# Altium schematic sheet Sheet1.SchDoc: Arduino_Nano
size A; Author: Hassan Mustafa; CompanyName: ControlMan; SheetNumber: 1; SheetTotal: 1
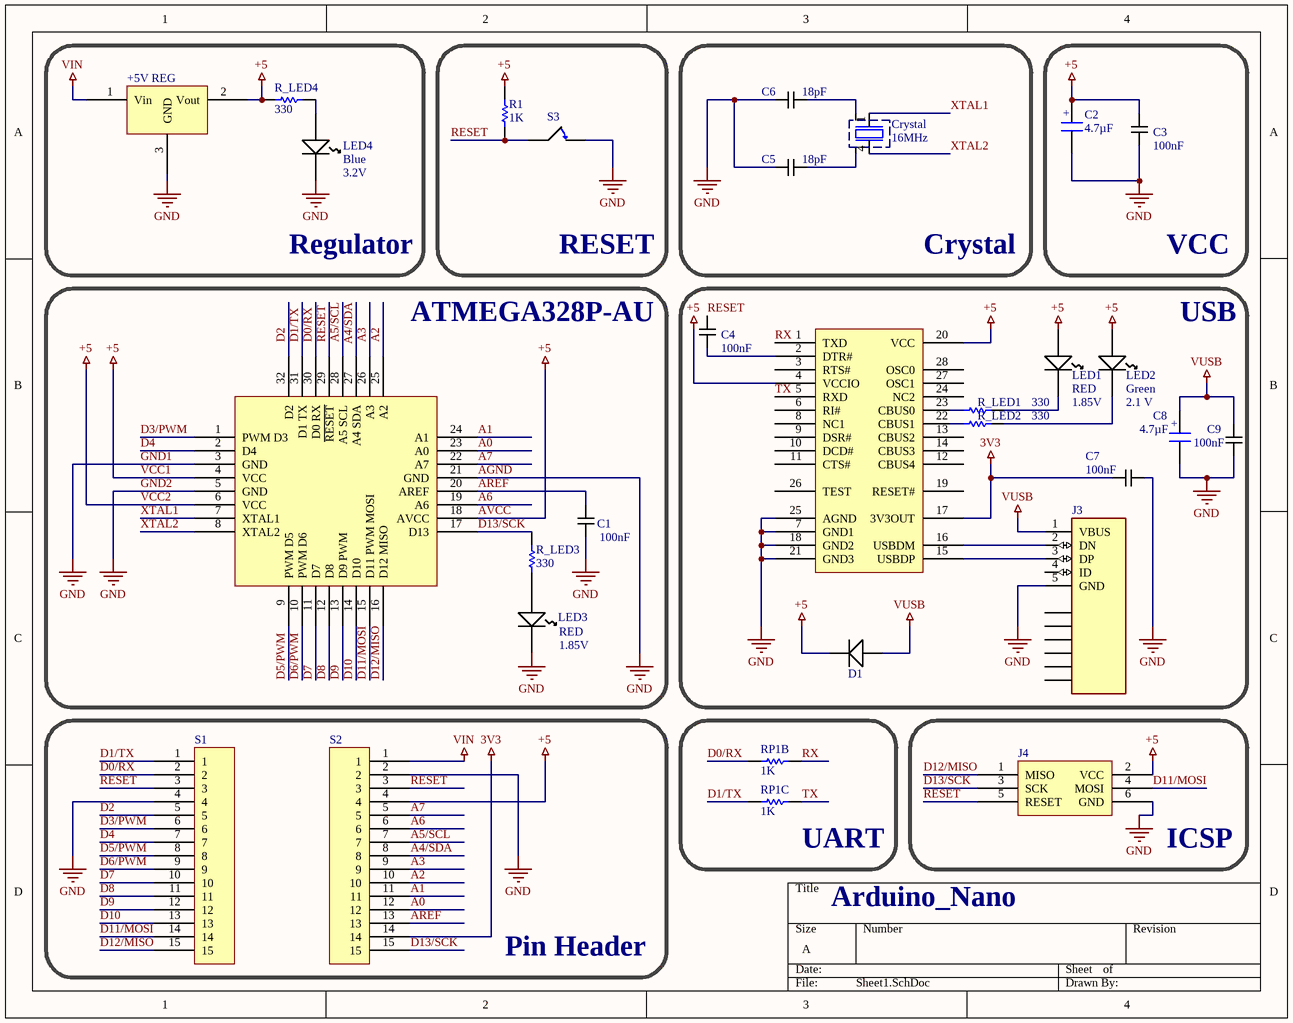
[diagram p0: Sheet1.SchDoc]

## Parts
+5V_REG  LM1117MP-5.0/NOPB, Low Dropout Voltage Regulator, 1.5A, 5 V ±1%, 4-Pin SOT-223  [SOT230P700X180-4N]  (value not drawn)
C1  Capacitance: 100nF  [CAPCP2012X09N]  (hidden comment: 100nF Ceramic Multilayer Capacitor_1)
C2  value 4.7µF  [CASE A - 3216X18]  (hidden comment: Capacitor SMT Tantalum)
C3  Capacitance: 100nF  [CAPCP2012X09N]  (hidden comment: 100nF Ceramic Multilayer Capacitor_1)
C4  Capacitance: 100nF  [CAPCP2012X09N]  (hidden comment: 100nF Ceramic Multilayer Capacitor_1)
C5  Capacitance: 18pF  [CAPCP2012X09N]  (hidden comment: C0805C180J5GACTU)
C6  Capacitance: 18pF  [CAPCP2012X09N]  (hidden comment: C0805C180J5GACTU)
C7  Capacitance: 100nF  [CAPCP2012X09N]  (hidden comment: 100nF Ceramic Multilayer Capacitor_1)
C8  value 4.7µF  [CASE A - 3216X18]  (hidden comment: Capacitor SMT Tantalum)
C9  Capacitance: 100nF  [CAPCP2012X09N]  (hidden comment: 100nF Ceramic Multilayer Capacitor_1)
Crystal  value 16MHz  [Aker S5C Crystal]  (hidden comment: Aker 16MHz Crystal SMT)
D1  Panasonic DB2J20900L Schottky Diode, 0.5A, 20V, 2.4ns, 2-Pin SMini2 F5 B  [DIOM1712X07N]  (value not drawn)
J3  2013499-1  [TE_2013499-1]  (value not drawn)
J4  Programming Headers Dual Row  [ISP HEADER]  (value not drawn)
LED1  Color: RED  Forward Voltage: 1.85V  [LED1913X12NRED]  (hidden comment: Kingbright Red LED, 100 mcd 120 ° 0805)
LED2  Color: Green  Forward Voltage: 2.1 V  [LED1913X12NGREEN]  (hidden comment: Kingbright Green LED, 70 mcd 120 ° 0805)
LED3  Color: RED  Forward Voltage: 1.85V  [LED1913X12NRED]  (hidden comment: Kingbright Red LED, 100 mcd 120 ° 0805)
LED4  Color: Blue  Forward Voltage: 3.2V  [LED1913X12NBLUE]  (hidden comment: Kingbright Blue LED, 60 mcd 120 ° 0805)
MicroController  ATMEGA328P-AU  [TQFP80P900X900X120-32N]
R1  value 1K  (hidden comment: Resistor)
R_LED1  value 330  (hidden comment: Resistor)
R_LED2  value 330  (hidden comment: Resistor)
R_LED3  value 330  (hidden comment: Resistor)
R_LED4  value 330  (hidden comment: Resistor)
RP1B  value 1K  (hidden comment: Resistor)
RP1C  value 1K  (hidden comment: Resistor)
S1  connector;str header;single row;.1 cont centers;.095 tail;gold or gtx;36 contact  [Header]  (value not drawn)
S2  connector;str header;single row;.1 cont centers;.095 tail;gold or gtx;36 contact  [Header]  (value not drawn)
S3  Button Tactile Switch, NO 0.05 A 0.8mm  [Button8014X17N]  (value not drawn)
USB  FT232RL, Universal Asynchronous Receiver & Transmitter 3MBd, 28-Pin, SSOP  [SOP65P780X200-28N]  (value not drawn)

## Blocks framed on the sheet
Regulator: +5V_REG LED4 R_LED4
RESET: R1 S3
Crystal: C5 C6 Crystal
VCC: C2 C3
Pin Header: S1 S2
UART: RP1B RP1C
ICSP: J4

## Nets
3V3: C7.1 S2.14 USB.17(3V3OUT)
AGND: +5V_REG.3(GND) C1.1 C2.2 C3.1 C5.2 C6.2 C7.2 C8.2 C9.1 J3.5(GND) J4.6(GND) LED3.2(K) LED4.2(K) MicroController.3(GND) MicroController.5(GND) MicroController.21(GND) S1.4 S2.2 S3.1 USB.7(GND1) USB.18(GND2) USB.21(GND3) USB.25(AGND)  [also labelled GND, GND1, GND2]
AVCC: +5V_REG.2(Vout) C2.1 C3.2 D1.1 J4.2(VCC) LED1.1(A) LED2.1(A) MicroController.4(VCC) MicroController.6(VCC) MicroController.18(AVCC) R1.2 R_LED4.1 S2.4 USB.4(VCCIO) USB.20(VCC)  [also labelled +5, VCC1, VCC2]
VIN: +5V_REG.1(Vin) S2.1
VUSB: C8.1 C9.2 D1.2 J3.1(VBUS)
A0: MicroController.23(A0) S2.12
A1: MicroController.24(A1) S2.11
A2: MicroController.25(A2) S2.10
A3: MicroController.26(A3) S2.9
A4/SDA: MicroController.27(A4_SDA) S2.8
A5/SCL: MicroController.28(A5_SCL) S2.7
A6: MicroController.19(A6) S2.6
A7: MicroController.22(A7) S2.5
AREF: C1.2 MicroController.20(AREF) S2.13
D0/RX: MicroController.30(D0_RX) RP1B.1 S1.2
D1/TX: MicroController.31(D1_TX) RP1C.1 S1.1
D2: MicroController.32(D2) S1.5
D3/PWM: MicroController.1(PWM_D3) S1.6
D4: MicroController.2(D4) S1.7
D5/PWM: MicroController.9(PWM_D5) S1.8
D6/PWM: MicroController.10(PWM_D6) S1.9
D7: MicroController.11(D7) S1.10
D8: MicroController.12(D8) S1.11
D9: MicroController.13(D9_PWM) S1.12
D10: MicroController.14(D10) S1.13
D11/MOSI: J4.4(MOSI) MicroController.15(D11_PWM_MOSI) S1.14
D12/MISO: J4.1(MISO) MicroController.16(D12_MISO) S1.15
D13/SCK: J4.3(SCK) MicroController.17(D13) R_LED3.2 S2.15
RESET: C4.2 J4.5(RESET) MicroController.29(~{RESET}) R1.1 S1.3 S2.3 S3.1
RX: RP1B.2 USB.1(TXD)
TX: RP1C.2 USB.5(RXD)
XTAL1: Crystal.1 MicroController.7(XTAL1)
XTAL2: Crystal.4 MicroController.8(XTAL2)
NetC4_1: C4.1 USB.2(DTR#)
NetC5_1: C5.1 Crystal.2(Gnd)
NetC6_1: C6.1 Crystal.3(Gnd)
NetJ3_2: J3.2(DN) USB.16(USBDM)
NetJ3_3: J3.3(DP) USB.15(USBDP)
NetLED1_2: LED1.2(K) R_LED1.1
NetLED2_2: LED2.2(K) R_LED2.1
NetLED3_1: LED3.1(A) R_LED3.1
NetLED4_1: LED4.1(A) R_LED4.2
NetR_LED1_2: R_LED1.2 USB.23(CBUS0)
NetR_LED2_2: R_LED2.2 USB.22(CBUS1)

Not connected (* = marked no-connect by the designer): J3 4(ID) SH1(SHIELD) SH2(SHIELD) SH3(SHIELD) SH4(SHIELD) SH5(SHIELD) SH6(SHIELD); USB 3(RTS#) 6(RI#) 8(NC1) 9(DSR#) 10(DCD#) 11(CTS#) 12(CBUS4) 13(CBUS2) 14(CBUS3) 19(RESET#) 24(NC2) 26(TEST) 27(OSC1) 28(OSC0)

## Notes on the sheet
- (in symbol 4.7µF Tant RS 496-3545) +

## Library data of the parts
+5V_REG = LM1117MP-5.0: Manufacturer: Texas Instruments; Supply Current: 1.5Amps; Output Voltage: 5V; Maximum Input Voltage: 15V; Date Created: 26 February 2015; Created By: R Kanjee; RS Stock No.: 533-9583; Datasheet URL: http://za.rs-online.com/web/p/low-dropout-voltage-regulators/5339583/
C1 C3 C4 C7 C9 = 100nF Ceramic Multilayer Capacitor_1: AVX 0805 Standard 100nF Ceramic Multilayer Capacitor, 50 V dc X7R Dielectric ±10% SMD; Voltage: 50V; Creator: Ritesh Kanjee; Date Created: 18 February 2015; Package: 0805; Manufacturer: AVX; RS Stock No.: 464-6688; Datasheet URL: http://za.rs-online.com/web/p/ceramic-multilayer-capacitors/4646688/
C2 C8 = 4.7µF Tant RS 496-3545: Capacitor,tantalum,SMT,16V,4.7uF,10%,A-case; Part Originator: H Theron; RS Stock Nr.: 496-3545; Tolerance: 10%; Package: 3216-18; Publisher: DPSS; LatestRevisionDate: 28-April-2010; ComponentLink1Description: Supplier Website; ComponentLink1URL: http://za.rs-online.com/web/search/searchBrowseAction.html?method=getProduct&R=4963545; ComponentLink2Description: RS Data sheet; ComponentLink2URL: http://docs-europe.origin.electrocomponents.com/webdocs/04ed/0900766b804ed4cc.pdf; Voltage: 16V
C5 C6 = 18pF Ceramic Multilayer Capacitor, 50 V dc C0G Dielectric ±5% SMD: Manufacturer: Kemet; Voltage: 50V; Creator: Ritesh Kanjee; Date Created: 18 February 2015; Package: 0805; RS Stock No.: 648-0935; Datasheet URL: http://za.rs-online.com/web/p/ceramic-multilayer-capacitors/6480935/?searchTerm=C0805C180J5GACTU&relevancy-data=636F3D3226696E3D4931384E4B6E6F776E41734D504E266C753D656E266D6D3D6D61746368616C6C7061727469616C26706D3D5E5B5C707B4C7D5C707B4E647D2D2C2F255C2E5D2B2426706F3D313326736E3D592673743D4D414E5F504152545F4E554D4245522677633D424F5448267573743D4330383035433138304A35474143545526
Crystal = Aker  C5S-16.000-12-3030-X: Aker S5C SMT Crystal; Load Capacitance: 12pF; Frequency Stability: +/-30ppm; RS: RS 671-9488; Creator: R Kanjee; Manufacturer: Aker; Manufacturer Part #: C5S-16.000-12-3030-X; Supplier: RS; RS Stock Nr.: 671-9488; HelpURL: http://za.rs-online.com/web/p/crystal-units/6719488/; Package: 3.2x5mm SMD
D1 = Schottky Diode, 0.5A, 20V, 2.4ns, 2-Pin SMini2 F5 B: Created By: R Kanjee; Date Created: 1 March 2015; Manufacturer: Panasonic; RS Stock No.: 713-2703; Manufacturer Part No.: DB2J20900L; Datasheet: http://docs-europe.electrocomponents.com/webdocs/1398/0900766b813986b3.pdf; Maximum Continuous Forward Current: 0.5A; Peak Reverse Repetitive Voltage: 20V
J4 = Programming ISP, Programming Headers Dual Row: Manufacturer: FCI; Manufacturer Part No.: 68000-236HLF; Current Rating: 3Amps Continuous; Created By: R Kanjee; Date Created: 1 March 2015; RS Stock No.: 2509565626
LED1 LED3 = Kingbright Red LED, 100 mcd 120 ° 0805: Manufacturer Part No.: KP-2012SRC-PRV; Creator: Ritesh Kanjee; Date Created: 18 February 2015; Manufacturer: KingBright; RS Stock No.: 466-3813; Datasheet URL: http://za.rs-online.com/web/p/visible-leds/4663813/
LED2 = Kingbright Green LED, 70 mcd 120 ° 0805: Manufacturer Part No.: KP-2012MGC; Creator: Ritesh Kanjee; Date Created: 18 February 2015; Manufacturer: KingBright; RS Stock No.: 466-3778; Datasheet URL: http://za.rs-online.com/web/p/visible-leds/4663778/
LED4 = Kingbright Blue LED, 60 mcd 120 ° 0805: Manufacturer Part No.: KP-2012PBC-A; Creator: Ritesh Kanjee; Date Created: 18 February 2015; Manufacturer: KingBright; RS Stock No.: 466-3784; Datasheet URL: http://za.rs-online.com/web/p/visible-leds/4663784/
MicroController = ATMEGA328P-AU: ATMEGA328P-AU, 8 bit AVR Microcontroller 20MHz 1 kB, 32 kB Flash, 2 kB RAM, I2C 32-Pin TQFP; Company: Lumina Inova; Created By: Ritesh Kanjee; Date Created: 14 February 2015; RS Stock No.: 696-3092; Datasheet URL: http://docs-europe.electrocomponents.com/webdocs/0db4/0900766b80db4deb.pdf
R1 R_LED1-R_LED4 RP1B RP1C = Resistor: TC1: 0; SimulationGenericComponent: True; TC2: 0
S1 S2 = Single row; PCB headers: Manufacturer: FCI; Manufacturer Part No.: 68000-236HLF; Current Rating: 3Amps Continuous; Created By: R Kanjee; Date Created: 1 March 2015; RS Stock No.: 2509565626
S3 = Button Tactile Switch, NO 0.05 A 0.8mm: Manufacturer: C & K; Manufacturer Part No.: B3F1000; State: Normaly Open; Date Created: 25 February 2015; Creator: R Kanjee; RS Stock No.: 516-255
USB = FT232RL USB to UART, Universal Asynchronous Receiver & Transmitter 3MBd, 28-Pin, SSOP: Manufacturer: FTDI Chip; Creator: R Kanjee; Date Created: 03 March 2015; Manufacturer Part No.: FT232RL; RS Stock No.: 406-580; Pin Count: 28
J3 = 2013499-1: Package: None; Price: None; Value: *; MP: 2013499-1; Availability: Unavailable